# Altium schematic sheet fpgaConfig.SchDoc: FPGA Configurtion
size A; SheetNumber: 2; SheetTotal: 3
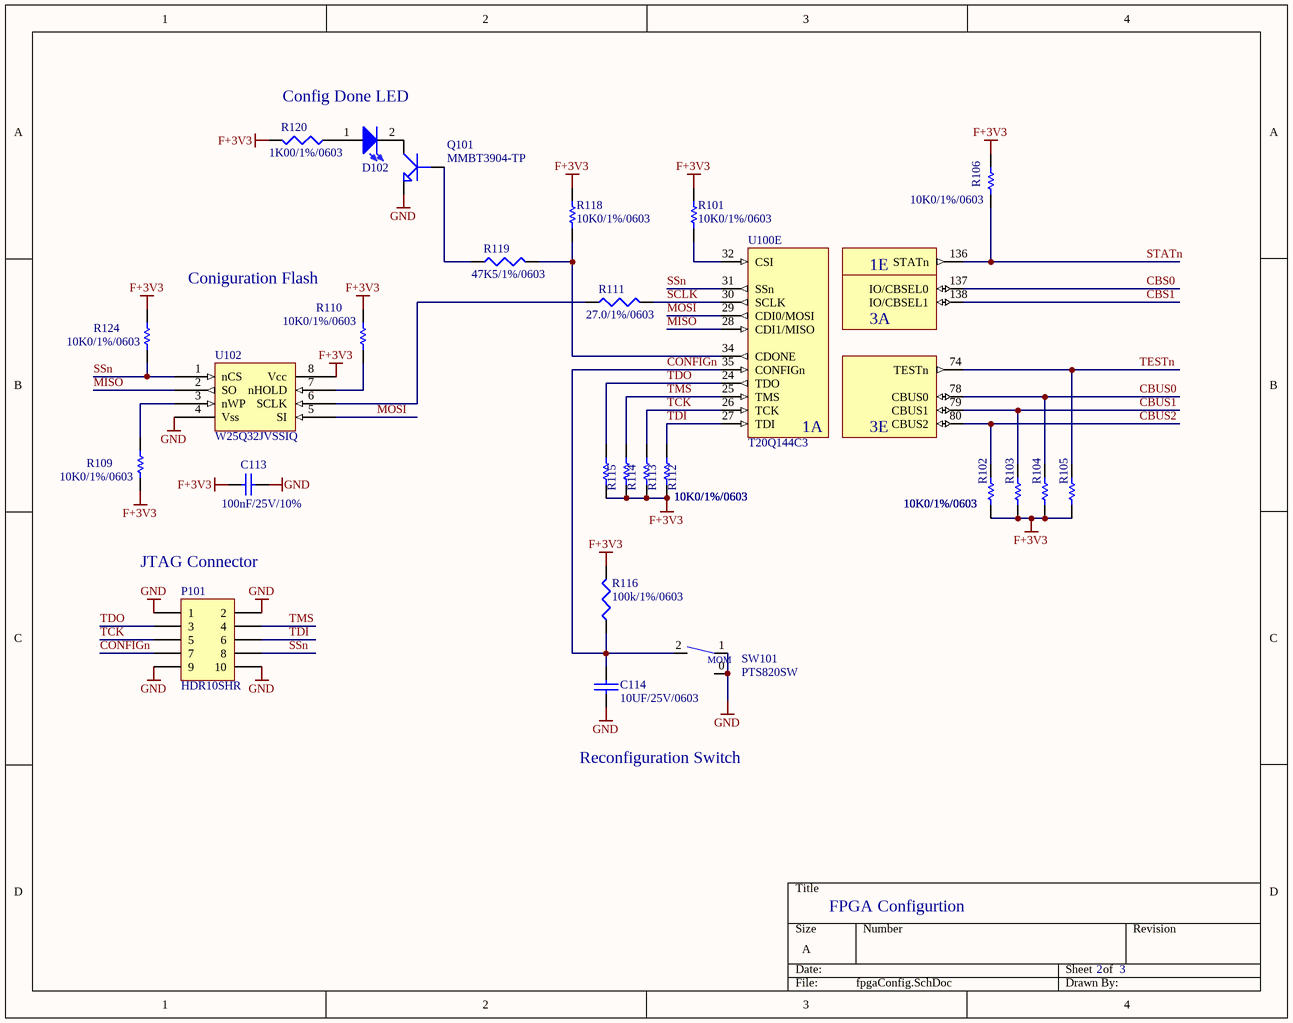
[diagram p0: fpgaConfig.SchDoc]

## Parts
C113  100nF/25V/10%  [MY0603]
C114  10UF/25V/0603  [0603]
D102  LTST-C191KGKT  [LED0603]  (value not drawn)
P101  HDR10SHR  [HDR10]
Q101  MMBT3904-TP  [SOT-23]
R101  10K0/1%/0603  [0603]
R102  10K0/1%/0603  [0603]
R103  10K0/1%/0603  [0603]
R104  10K0/1%/0603  [0603]
R105  10K0/1%/0603  [0603]
R106  10K0/1%/0603  [0603]
R109  10K0/1%/0603  [0603]
R110  10K0/1%/0603  [0603]
R111  27.0/1%/0603  [0603]
R112  10K0/1%/0603  [0603]
R113  10K0/1%/0603  [0603]
R114  10K0/1%/0603  [0603]
R115  10K0/1%/0603  [0603]
R116  100k/1%/0603  [0603]
R118  10K0/1%/0603  [0603]
R119  47K5/1%/0603  [0603]
R120  1K00/1%/0603  [0603]
R124  10K0/1%/0603  [0603]
SW101  PTS820SW  [PTS820]
U100  T20Q144C3  [LQFP144]  (part E of 6)
U102  W25Q32JVSSIQ  [so8w]

## Nets
F+3V3: C113.2 R101.2 R102.1 R103.1 R104.1 R105.1 R106.2 R109.1 R110.1 R112.1 R113.1 R114.1 R115.1 R116.2 R118.2 R120.2 R124.2 U102.8(Vcc)
GND: C113.1 C114.2 P101.1 P101.2 P101.9 P101.10 Q101.2(EMITTER) SW101.0 SW101.1 U102.4(Vss)
CBS0: U100.137(IO/CBSEL0)
CBS1: U100.138(IO/CBSEL1)
CBUS0: R104.2 U100.78(CBUS0)
CBUS1: R103.2 U100.79(CBUS1)
CBUS2: R102.2 U100.80(CBUS2)
CONFIGn: C114.1 P101.7 R116.1 SW101.2 U100.35(CONFIGn)
MISO: U100.28(CDI1/MISO) U102.2(SO)
MOSI: U100.29(CDI0/MOSI) U102.5(SI)
SCLK: R111.2 U100.30(SCLK)
SSn: P101.8 R124.1 U100.31(SSn) U102.1(nCS)
STATn: R106.1 U100.136(STATn)
TCK: P101.5 R113.2 U100.26(TCK)
TDI: P101.6 R112.2 U100.27(TDI)
TDO: P101.3 R115.2 U100.24(TDO)
TESTn: R105.2 U100.74(TESTn)
TMS: P101.4 R114.2 U100.25(TMS)
NetD102_1: D102.1(A) R120.1
NetD102_2: D102.2(K) Q101.3(COLLECTOR)
NetQ101_1: Q101.1(BASE) R119.1
NetR101_1: R101.1 U100.32(CSI)
NetR109_2: R109.2 U102.3(nWP)
NetR110_2: R110.2 U102.7(nHOLD)
NetR111_1: R111.1 U102.6(SCLK)
NetR118_1: R118.1 R119.2 U100.34(CDONE)

## Notes on the sheet
- Config Done LED
- Coniguration Flash
- (near P101) JTAG Connector
- Reconfiguration Switch
- (in symbol PTS820SW) MOM
- (in symbol T20Q144C3, part E) 1E; 3A; 1A; 3E

## Library data of the parts
C113 = CAP100NF25V: 0.1µF ±10% 25V Ceramic Capacitor X7R 0603 (1608 Metric); MFG PN: 06033C104KAT2A; DK PN: 478-3714-1-ND; MFG: AVX; FOOTPRINT: 0603; Populate: *
C114 = 10UF/25V/0603: 10 µF ±20% 25V Ceramic Capacitor X5R 0603 (1608 Metric); MFG: Samsung; MFG PN: CL10A106MA8NRNC; DK PN: 1276-1869-1-ND; Price: 1.17
D102 = LTST-C191KGKT: Green 571nm LED Indication - Discrete 2V 0603 (1608 Metric); DK PN: 160-1446-1-ND; MFG: Liteon; MFG PN: LTST-C191KGKT; Populate: *
P101 = HDR10SHR: Connector Header Through Hole 10 position 0.100" (2.54mm); MFG: On Shore; MFG PN: 302-S101; DK PN: ED1543-ND; Populate: *
Q101 = MMBT3904-TP: Bipolar (BJT) Transistor NPN 40 V 200 mA 300MHz 350 mW Surface Mount SOT-23; MFG: Micro Commercial; DK PN: MMBT3904TPMSCT-ND; MFG PN: MMBT3904-TP; Price: 0.58000
R101-R106 R109 R110 R112-R115 R118 R124 = RES10K0: 10k Ohm ±1% 0.1W, 1/10W Chip Resistor 0603 (1608 Metric) Moisture Resistant Thick Film; MFG PN: RC0603FR-0710KL; DK PN: 311-10.0KHRTR-ND; MFG: Yageo; Populate: *
R111 = 27.0/1%/0603: 27 Ohms ±1% 0.1W, 1/10W Chip Resistor 0603 (1608 Metric) Moisture Resistant Thick Film; MFG: Yeago; MFG PN: RC0603FR-0727RL; DK PN: 311-27.0HRCT-ND
R116 = 100k/1%/0603: 100 kOhms ±1% 0.1W, 1/10W Chip Resistor 0603 (1608 Metric) Moisture Resistant Thick Film; MFG: Yeago; MFG PN: RC0603FR-07100KL; DK PN: 311-100KHRCT-ND
R119 = 47K5/1%/0603: 47.5 kOhms ±1% 0.1W, 1/10W Chip Resistor 0603 (1608 Metric) Moisture Resistant Thick Film; MFG: Yeago; MFG PN: RC0603FR-0747K5L; DK PN: 311-47.5KHRCT-ND
R120 = 1K00/1%/0603: 1 kOhms ±1% 0.1W, 1/10W Chip Resistor 0603 (1608 Metric) Moisture Resistant Thick Film; MFG: Yeago; MFG PN: RC0603FR-071KL; DK PN: 311-1.00KHRCT-ND
SW101 = PTS820SW: Tactile Switch SPST-NO Top Actuated Surface Mount; MFG: C&K; MFG PN: PTS820 J20M SMTR LFS; DK PN: CKN10505CT-ND
U100 = T20Q144C3: Trion® Field Programmable Gate Array (FPGA) IC 97 1044 19728 144-LQFP; MFG: Efinix; DK PN: 2134-T20Q144C3-ND; MFG PN: T20Q144C3; FOOTPRINT: 144QFP; Populate: *
U102 = W25Q32JVSSIQ: FLASH - NOR Memory IC 32Mb (4M x 8) SPI - Quad I/O 133 MHz 8-SOIC; MFG: Winbond; MFG PN: W25Q32JVSSIQ TR; DK PN: W25Q32JVSSIQCT-ND